# EAGLE design LED_004 (EAGLE 7.3.0)
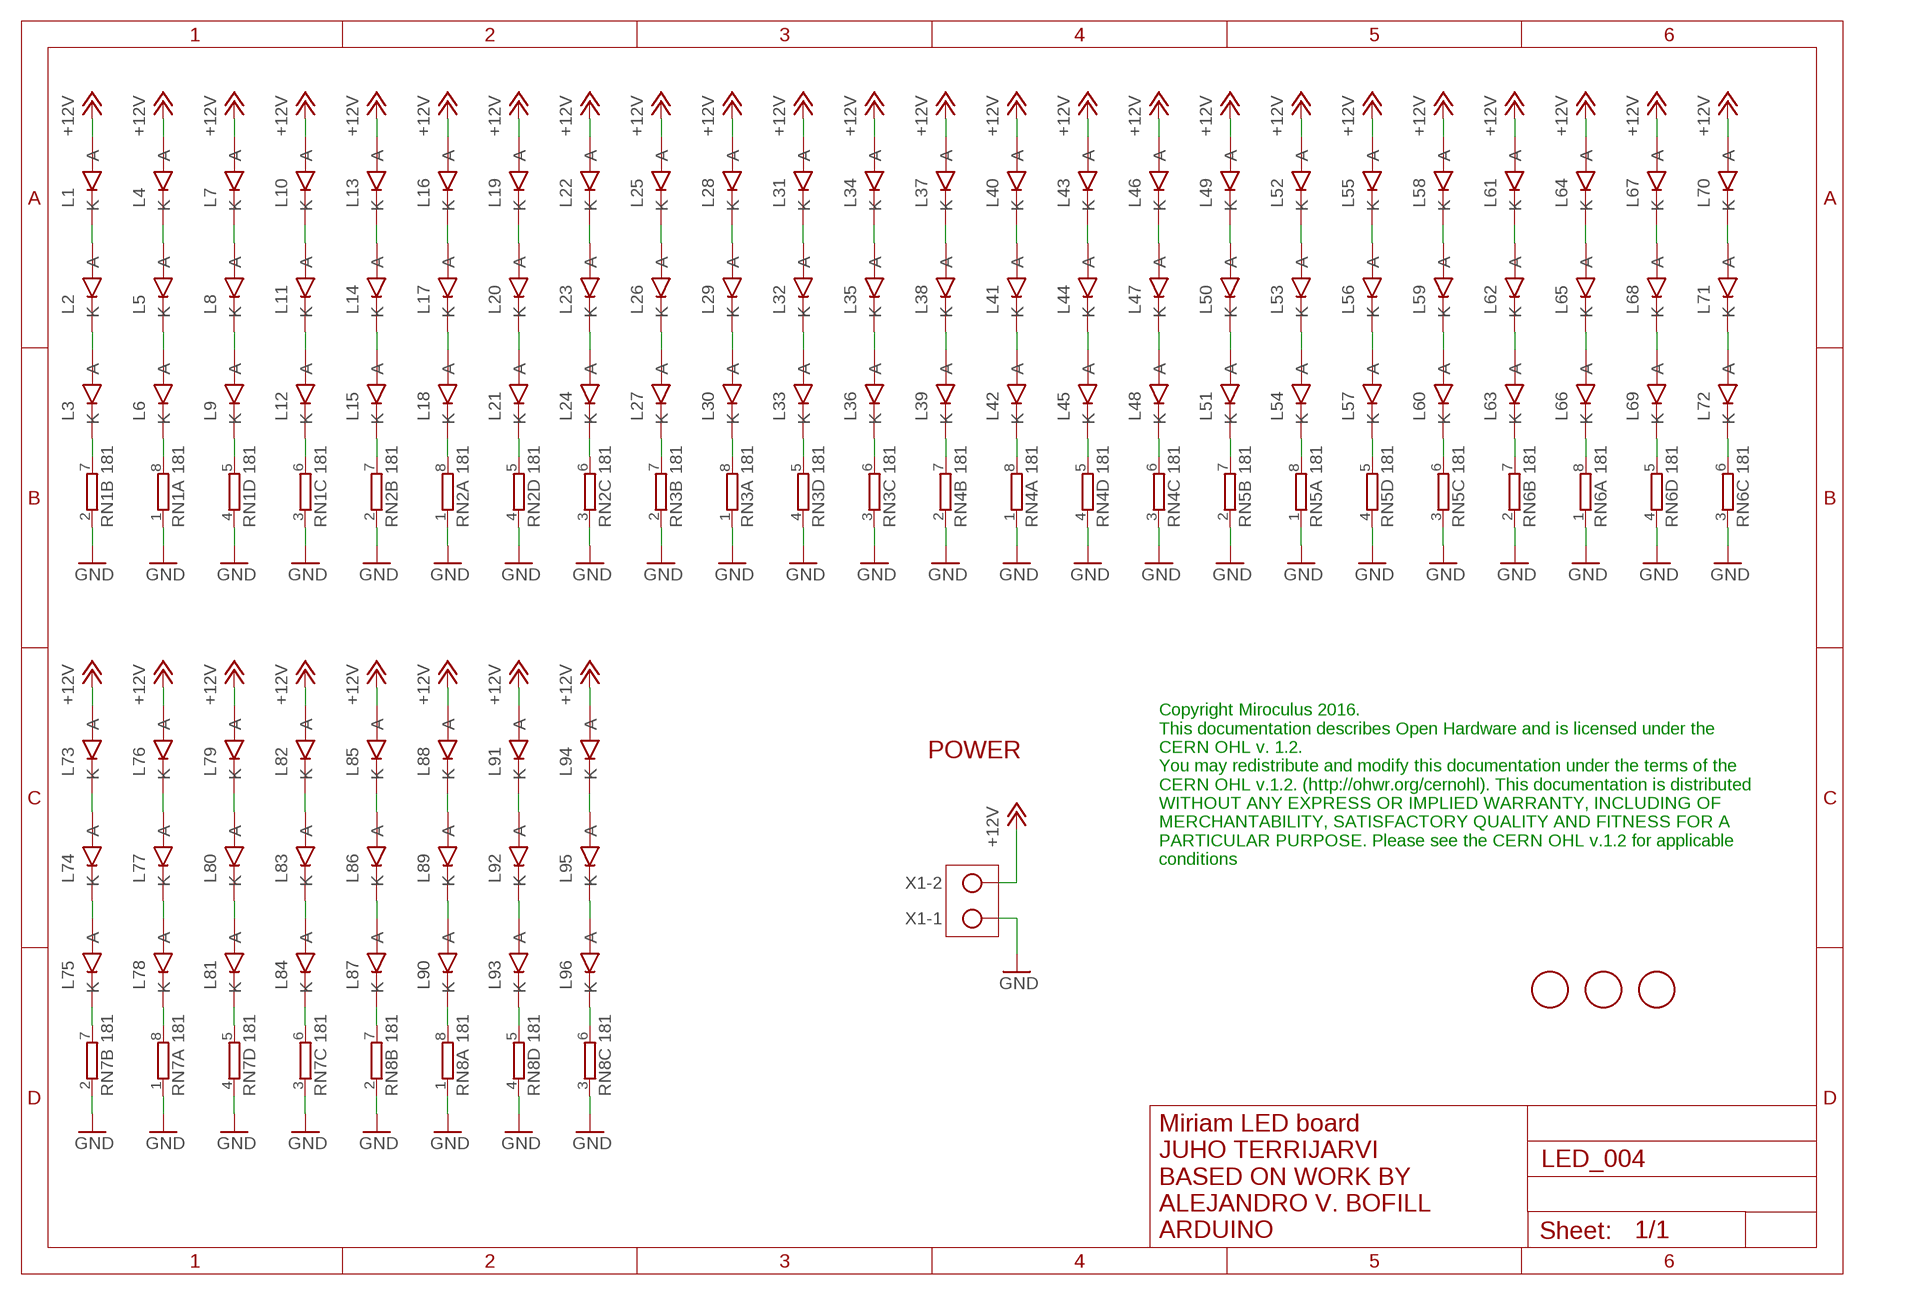
[diagram p0: schematic, sheet 1]

## Parts
FD1  FIDUCIALMOUNT  [FIDUCIA-MOUNT]
FD2  FIDUCIALMOUNT  [FIDUCIA-MOUNT]
FD3  FIDUCIALMOUNT  [FIDUCIA-MOUNT]
L1  KA-2810AQBS-G  LED_0.2  [LED_0.2]
L2  KA-2810AQBS-G  LED_0.2  [LED_0.2]
L3  KA-2810AQBS-G  LED_0.2  [LED_0.2]
L4  KA-2810AQBS-G  LED_0.2  [LED_0.2]
L5  KA-2810AQBS-G  LED_0.2  [LED_0.2]
L6  KA-2810AQBS-G  LED_0.2  [LED_0.2]
L7  KA-2810AQBS-G  LED_0.2  [LED_0.2]
L8  KA-2810AQBS-G  LED_0.2  [LED_0.2]
L9  KA-2810AQBS-G  LED_0.2  [LED_0.2]
L10  KA-2810AQBS-G  LED_0.2  [LED_0.2]
L11  KA-2810AQBS-G  LED_0.2  [LED_0.2]
L12  KA-2810AQBS-G  LED_0.2  [LED_0.2]
L13  KA-2810AQBS-G  LED_0.2  [LED_0.2]
L14  KA-2810AQBS-G  LED_0.2  [LED_0.2]
L15  KA-2810AQBS-G  LED_0.2  [LED_0.2]
L16  KA-2810AQBS-G  LED_0.2  [LED_0.2]
L17  KA-2810AQBS-G  LED_0.2  [LED_0.2]
L18  KA-2810AQBS-G  LED_0.2  [LED_0.2]
L19  KA-2810AQBS-G  LED_0.2  [LED_0.2]
L20  KA-2810AQBS-G  LED_0.2  [LED_0.2]
L21  KA-2810AQBS-G  LED_0.2  [LED_0.2]
L22  KA-2810AQBS-G  LED_0.2  [LED_0.2]
L23  KA-2810AQBS-G  LED_0.2  [LED_0.2]
L24  KA-2810AQBS-G  LED_0.2  [LED_0.2]
L25  KA-2810AQBS-G  LED_0.2  [LED_0.2]
L26  KA-2810AQBS-G  LED_0.2  [LED_0.2]
L27  KA-2810AQBS-G  LED_0.2  [LED_0.2]
L28  KA-2810AQBS-G  LED_0.2  [LED_0.2]
L29  KA-2810AQBS-G  LED_0.2  [LED_0.2]
L30  KA-2810AQBS-G  LED_0.2  [LED_0.2]
L31  KA-2810AQBS-G  LED_0.2  [LED_0.2]
L32  KA-2810AQBS-G  LED_0.2  [LED_0.2]
L33  KA-2810AQBS-G  LED_0.2  [LED_0.2]
L34  KA-2810AQBS-G  LED_0.2  [LED_0.2]
L35  KA-2810AQBS-G  LED_0.2  [LED_0.2]
L36  KA-2810AQBS-G  LED_0.2  [LED_0.2]
L37  KA-2810AQBS-G  LED_0.2  [LED_0.2]
L38  KA-2810AQBS-G  LED_0.2  [LED_0.2]
L39  KA-2810AQBS-G  LED_0.2  [LED_0.2]
L40  KA-2810AQBS-G  LED_0.2  [LED_0.2]
L41  KA-2810AQBS-G  LED_0.2  [LED_0.2]
L42  KA-2810AQBS-G  LED_0.2  [LED_0.2]
L43  KA-2810AQBS-G  LED_0.2  [LED_0.2]
L44  KA-2810AQBS-G  LED_0.2  [LED_0.2]
L45  KA-2810AQBS-G  LED_0.2  [LED_0.2]
L46  KA-2810AQBS-G  LED_0.2  [LED_0.2]
L47  KA-2810AQBS-G  LED_0.2  [LED_0.2]
L48  KA-2810AQBS-G  LED_0.2  [LED_0.2]
L49  KA-2810AQBS-G  LED_0.2  [LED_0.2]
L50  KA-2810AQBS-G  LED_0.2  [LED_0.2]
L51  KA-2810AQBS-G  LED_0.2  [LED_0.2]
L52  KA-2810AQBS-G  LED_0.2  [LED_0.2]
L53  KA-2810AQBS-G  LED_0.2  [LED_0.2]
L54  KA-2810AQBS-G  LED_0.2  [LED_0.2]
L55  KA-2810AQBS-G  LED_0.2  [LED_0.2]
L56  KA-2810AQBS-G  LED_0.2  [LED_0.2]
L57  KA-2810AQBS-G  LED_0.2  [LED_0.2]
L58  KA-2810AQBS-G  LED_0.2  [LED_0.2]
L59  KA-2810AQBS-G  LED_0.2  [LED_0.2]
L60  KA-2810AQBS-G  LED_0.2  [LED_0.2]
L61  KA-2810AQBS-G  LED_0.2  [LED_0.2]
L62  KA-2810AQBS-G  LED_0.2  [LED_0.2]
L63  KA-2810AQBS-G  LED_0.2  [LED_0.2]
L64  KA-2810AQBS-G  LED_0.2  [LED_0.2]
L65  KA-2810AQBS-G  LED_0.2  [LED_0.2]
L66  KA-2810AQBS-G  LED_0.2  [LED_0.2]
L67  KA-2810AQBS-G  LED_0.2  [LED_0.2]
L68  KA-2810AQBS-G  LED_0.2  [LED_0.2]
L69  KA-2810AQBS-G  LED_0.2  [LED_0.2]
L70  KA-2810AQBS-G  LED_0.2  [LED_0.2]
L71  KA-2810AQBS-G  LED_0.2  [LED_0.2]
L72  KA-2810AQBS-G  LED_0.2  [LED_0.2]
L73  KA-2810AQBS-G  LED_0.2  [LED_0.2]
L74  KA-2810AQBS-G  LED_0.2  [LED_0.2]
L75  KA-2810AQBS-G  LED_0.2  [LED_0.2]
L76  KA-2810AQBS-G  LED_0.2  [LED_0.2]
L77  KA-2810AQBS-G  LED_0.2  [LED_0.2]
L78  KA-2810AQBS-G  LED_0.2  [LED_0.2]
L79  KA-2810AQBS-G  LED_0.2  [LED_0.2]
L80  KA-2810AQBS-G  LED_0.2  [LED_0.2]
L81  KA-2810AQBS-G  LED_0.2  [LED_0.2]
L82  KA-2810AQBS-G  LED_0.2  [LED_0.2]
L83  KA-2810AQBS-G  LED_0.2  [LED_0.2]
L84  KA-2810AQBS-G  LED_0.2  [LED_0.2]
L85  KA-2810AQBS-G  LED_0.2  [LED_0.2]
L86  KA-2810AQBS-G  LED_0.2  [LED_0.2]
L87  KA-2810AQBS-G  LED_0.2  [LED_0.2]
L88  KA-2810AQBS-G  LED_0.2  [LED_0.2]
L89  KA-2810AQBS-G  LED_0.2  [LED_0.2]
L90  KA-2810AQBS-G  LED_0.2  [LED_0.2]
L91  KA-2810AQBS-G  LED_0.2  [LED_0.2]
L92  KA-2810AQBS-G  LED_0.2  [LED_0.2]
L93  KA-2810AQBS-G  LED_0.2  [LED_0.2]
L94  KA-2810AQBS-G  LED_0.2  [LED_0.2]
L95  KA-2810AQBS-G  LED_0.2  [LED_0.2]
L96  KA-2810AQBS-G  LED_0.2  [LED_0.2]
RN1  181  4R-NCAY16  [CAY16]
RN2  181  4R-NCAY16  [CAY16]
RN3  181  4R-NCAY16  [CAY16]
RN4  181  4R-NCAY16  [CAY16]
RN5  181  4R-NCAY16  [CAY16]
RN6  181  4R-NCAY16  [CAY16]
RN7  181  4R-NCAY16  [CAY16]
RN8  181  4R-NCAY16  [CAY16]
X1  MKDSN1,5/2-5,08  [MKDSN1,5/2-5,08]

## Nets
+12V [power12]: L1.2(A) L4.2(A) L7.2(A) L10.2(A) L13.2(A) L16.2(A) L19.2(A) L22.2(A) L25.2(A) L28.2(A) L31.2(A) L34.2(A) L37.2(A) L40.2(A) L43.2(A) L46.2(A) L49.2(A) L52.2(A) L55.2(A) L58.2(A) L61.2(A) L64.2(A) L67.2(A) L70.2(A) L73.2(A) L76.2(A) L79.2(A) L82.2(A) L85.2(A) L88.2(A) L91.2(A) L94.2(A) X1.2
GND [gnd]: RN1.1 RN1.2 RN1.3 RN1.4 RN2.1 RN2.2 RN2.3 RN2.4 RN3.1 RN3.2 RN3.3 RN3.4 RN4.1 RN4.2 RN4.3 RN4.4 RN5.1 RN5.2 RN5.3 RN5.4 RN6.1 RN6.2 RN6.3 RN6.4 RN7.1 RN7.2 RN7.3 RN7.4 RN8.1 RN8.2 RN8.3 RN8.4 X1.1
N$1: L1.1(K) L2.2(A)
N$2: L2.1(K) L3.2(A)
N$3: L3.1(K) RN1.7
N$4: L4.1(K) L5.2(A)
N$5: L5.1(K) L6.2(A)
N$6: L6.1(K) RN1.8
N$7: L7.1(K) L8.2(A)
N$8: L8.1(K) L9.2(A)
N$9: L9.1(K) RN1.5
N$10: L10.1(K) L11.2(A)
N$11: L11.1(K) L12.2(A)
N$12: L12.1(K) RN1.6
N$13: L13.1(K) L14.2(A)
N$14: L14.1(K) L15.2(A)
N$15: L16.1(K) L17.2(A)
N$16: L17.1(K) L18.2(A)
N$17: L19.1(K) L20.2(A)
N$18: L20.1(K) L21.2(A)
N$19: L22.1(K) L23.2(A)
N$20: L23.1(K) L24.2(A)
N$21: L15.1(K) RN2.7
N$22: L18.1(K) RN2.8
N$23: L21.1(K) RN2.5
N$24: L24.1(K) RN2.6
N$25: L25.1(K) L26.2(A)
N$26: L26.1(K) L27.2(A)
N$27: L28.1(K) L29.2(A)
N$28: L29.1(K) L30.2(A)
N$29: L31.1(K) L32.2(A)
N$30: L32.1(K) L33.2(A)
N$31: L34.1(K) L35.2(A)
N$32: L35.1(K) L36.2(A)
N$33: L27.1(K) RN3.7
N$34: L30.1(K) RN3.8
N$35: L33.1(K) RN3.5
N$36: L36.1(K) RN3.6
N$37: L37.1(K) L38.2(A)
N$38: L38.1(K) L39.2(A)
N$39: L40.1(K) L41.2(A)
N$41: L41.1(K) L42.2(A)
N$42: L43.1(K) L44.2(A)
N$43: L44.1(K) L45.2(A)
N$44: L46.1(K) L47.2(A)
N$45: L47.1(K) L48.2(A)
N$46: L39.1(K) RN4.7
N$47: L42.1(K) RN4.8
N$48: L45.1(K) RN4.5
N$49: L48.1(K) RN4.6
N$50: L49.1(K) L50.2(A)
N$51: L50.1(K) L51.2(A)
N$52: L52.1(K) L53.2(A)
N$53: L53.1(K) L54.2(A)
N$54: L55.1(K) L56.2(A)
N$55: L56.1(K) L57.2(A)
N$56: L58.1(K) L59.2(A)
N$57: L59.1(K) L60.2(A)
N$58: L51.1(K) RN5.7
N$59: L54.1(K) RN5.8
N$60: L57.1(K) RN5.5
N$61: L60.1(K) RN5.6
N$62: L61.1(K) L62.2(A)
N$63: L62.1(K) L63.2(A)
N$64: L64.1(K) L65.2(A)
N$65: L65.1(K) L66.2(A)
N$66: L67.1(K) L68.2(A)
N$67: L68.1(K) L69.2(A)
N$68: L70.1(K) L71.2(A)
N$69: L71.1(K) L72.2(A)
N$70: L63.1(K) RN6.7
N$71: L66.1(K) RN6.8
N$72: L69.1(K) RN6.5
N$73: L72.1(K) RN6.6
N$74: L73.1(K) L74.2(A)
N$75: L74.1(K) L75.2(A)
N$76: L76.1(K) L77.2(A)
N$77: L77.1(K) L78.2(A)
N$78: L79.1(K) L80.2(A)
N$79: L80.1(K) L81.2(A)
N$80: L82.1(K) L83.2(A)
N$81: L83.1(K) L84.2(A)
N$82: L96.1(K) RN8.6
N$83: L93.1(K) RN8.5
N$84: L90.1(K) RN8.8
N$85: L87.1(K) RN8.7
N$86: L85.1(K) L86.2(A)
N$87: L86.1(K) L87.2(A)
N$88: L88.1(K) L89.2(A)
N$89: L89.1(K) L90.2(A)
N$90: L91.1(K) L92.2(A)
N$91: L92.1(K) L93.2(A)
N$92: L94.1(K) L95.2(A)
N$93: L95.1(K) L96.2(A)
N$94: L84.1(K) RN7.6
N$95: L81.1(K) RN7.5
N$96: L78.1(K) RN7.8
N$97: L75.1(K) RN7.7

## Notes on the sheet
- POWER
- Copyright Miroculus 2016.
  This documentation describes Open Hardware and is licensed under the
  CERN OHL v. 1.2.
  You may redistribute and modify this documentation under the terms of the
  CERN OHL v.1.2. (http://ohwr.org/cernohl). This documentation is distributed
  WITHOUT ANY EXPRESS OR IMPLIED WARRANTY, INCLUDING OF
  MERCHANTABILITY, SATISFACTORY QUALITY AND FITNESS FOR A
  PARTICULAR PURPOSE. Please see the CERN OHL v.1.2 for applicable
  conditions
- Miriam LED board
  JUHO TERRIJARVI
  BASED ON WORK BY
  ALEJANDRO V. BOFILL
  ARDUINO

## Library data of the parts
FD1-FD3 = SmartPrj:FIDUCIALMOUNT
L1-L96 = Miroculus:LED_0.2
RN1-RN8 = resistor-dil:4R-N: Array Chip Resistor Source: RS Component / Phycomp; OC_FARNELL: unknown; OC_NEWARK: unknown
X1 = con-phoenix-508:MKDSN1,5/2-5,08: MKDSN 1,5/ 2-5,08 Printklemme Nennstrom: 13,5 A Nennspannung: 250 V Rastermaß: 5,08 mm Polzahl: 2 Anschlussart: Schraubanschluss Montage: Löten Anschlussrichtung Leiter/Platine: 0 ° Artikelnummer: 1729128 Source: http://eshop.phoenixcontact.com .. 1729128.pdf

## Net classes
0 default: width 0.254 mm, drill 0.406 mm, clearance 0.178 mm
1 power: width 0.406 mm, drill 0.813 mm, clearance 0.406 mm
2 gnd: width 0.254 mm, drill 0.406 mm, clearance 0.178 mm
3 power usb: width 0.305 mm, drill 0.406 mm, clearance 0.254 mm
4 power12: width 1.778 mm, drill 0.889 mm, clearance 0.406 mm

## Board
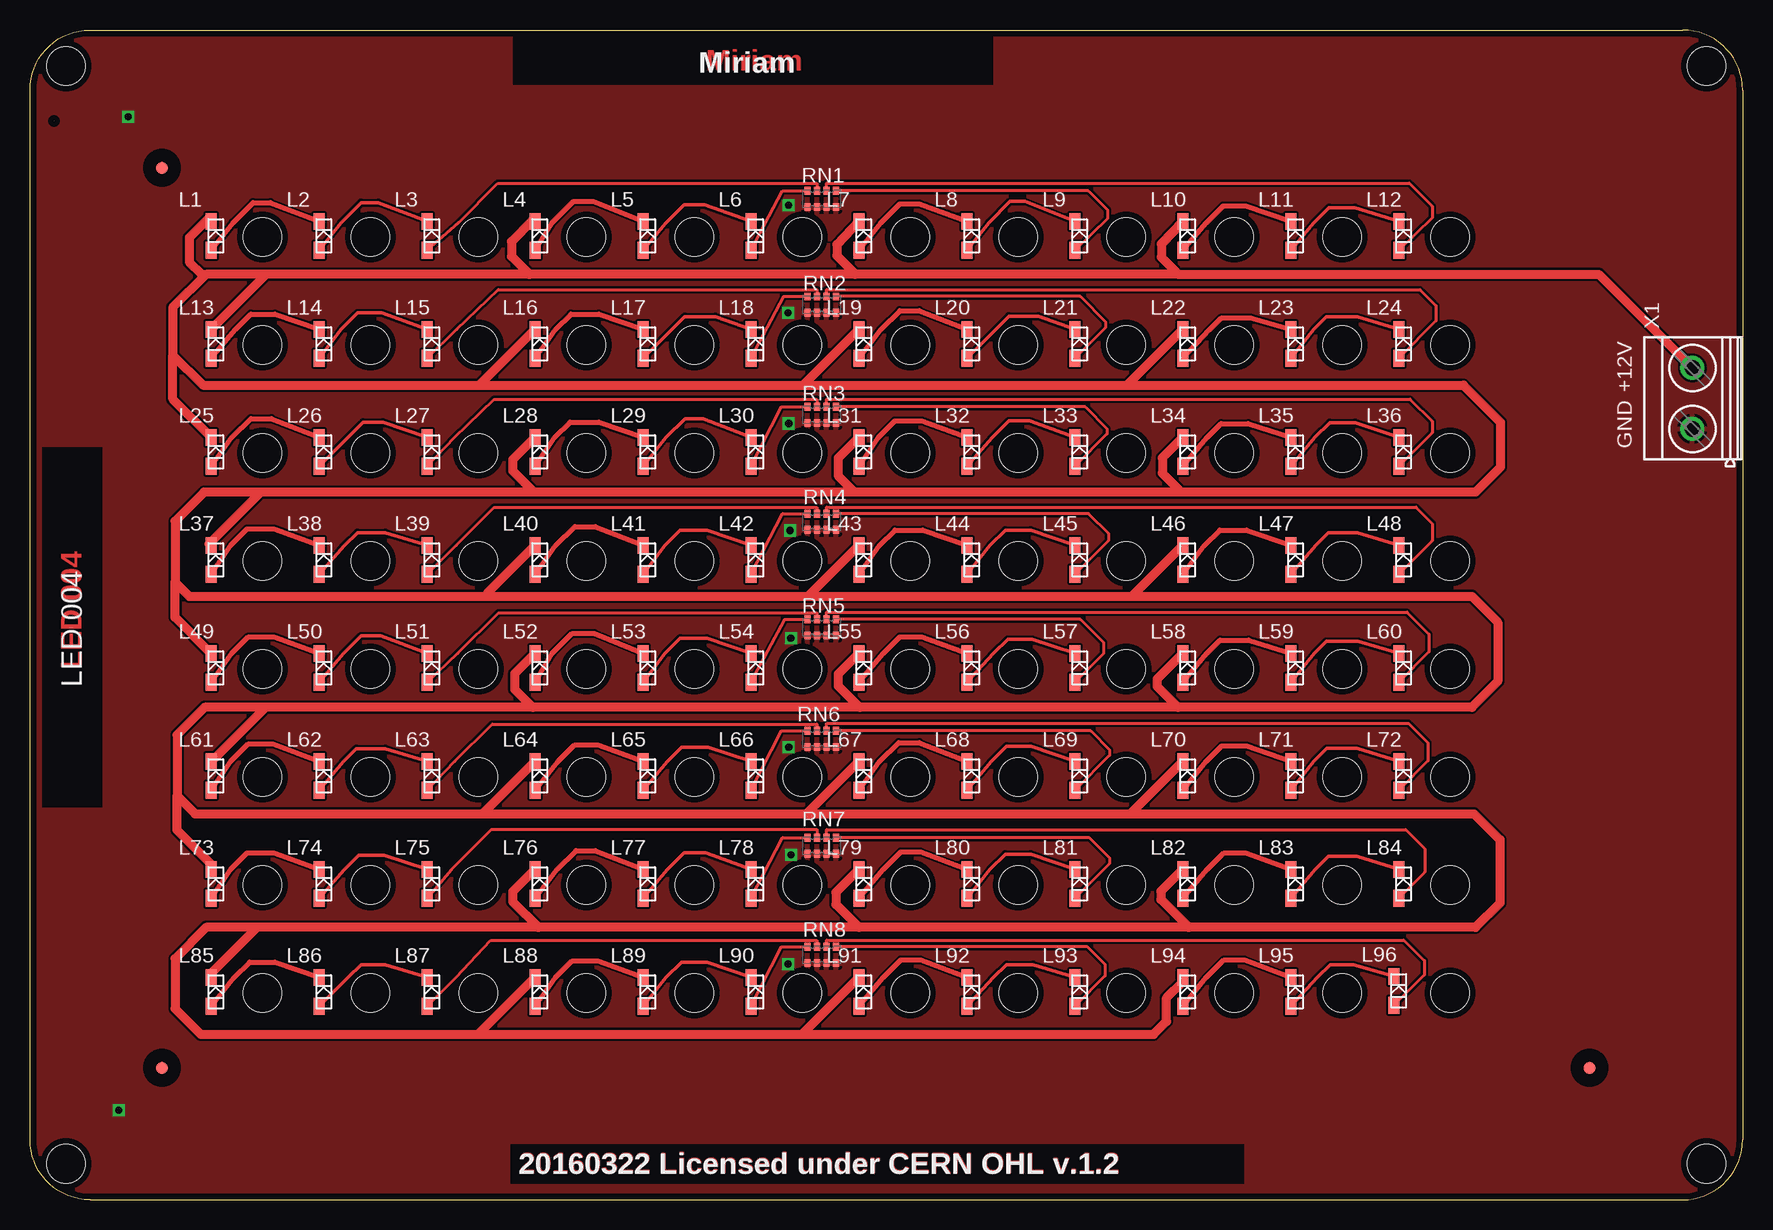
[diagram p1: board, top side]
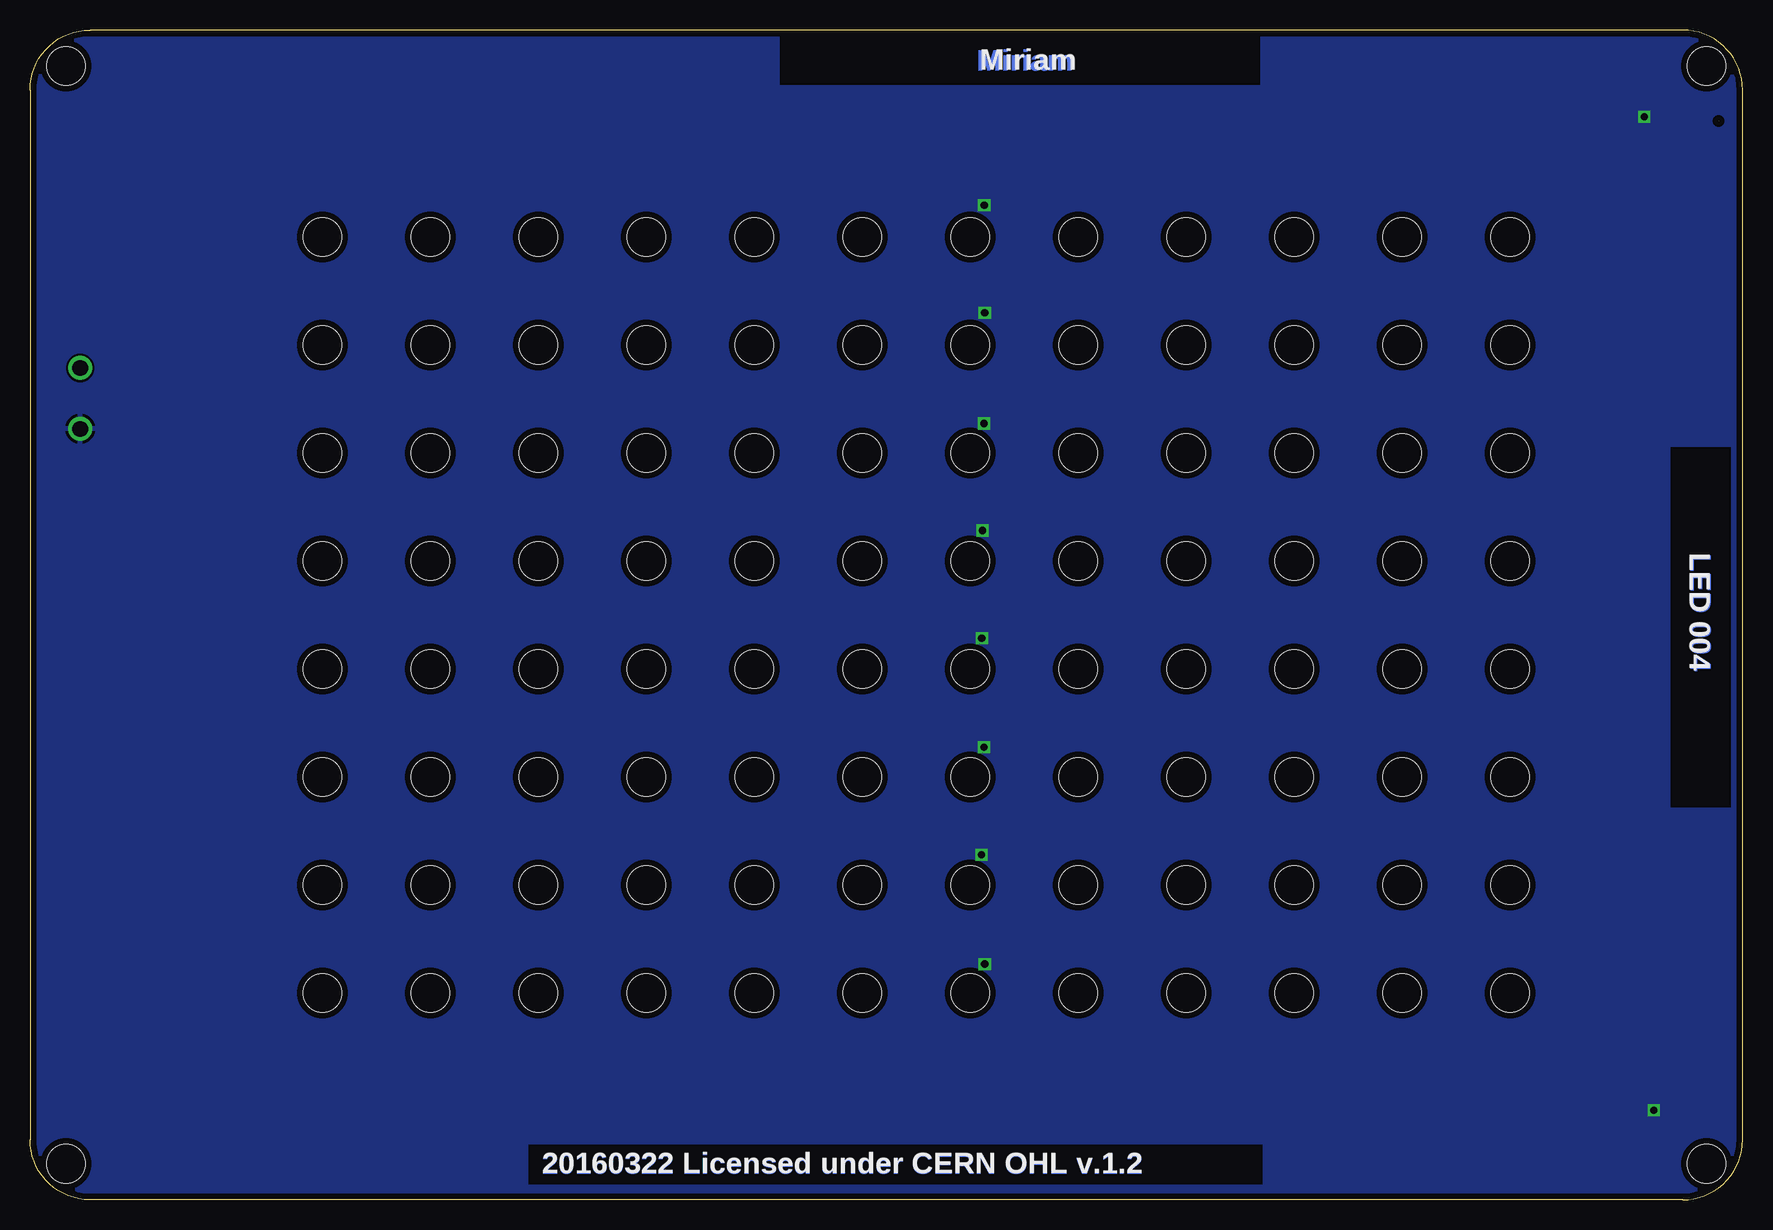
[diagram p2: board, bottom side, seen from below]

Size 142.76 x 97.48 mm. Coordinates in mm from the lower left corner, seen from the top.
Outline: 2.01,89.92 arc0 2.01,89.92
Outline: 5,0 137.76,0 arc90 142.76,5 142.76,92.48 arc90 137.76,97.48 5,97.48 arc90 0,92.48 0,5 arc90 5,0
Copper layers (1*16): Top 0.0178mm / dielectric 59mil / Bottom 0.0178mm
Design rules "SSC-EAGLE-2Lyr_v1.0.0.3": minimum track width 6mil, minimum drill 14mil, track to track 6mil, track to pad 6mil, pad to pad 6mil, via to via 6mil, smd to smd 6mil, copper to edge 20mil, drill to drill 16mil, minimum pad ring 8mil, minimum via ring 8mil, stop-mask expansion 3mil, vias tented up to drill 0mil, thermal gap 10mil
Holes 3.2 mm at 3,94.48 139.76,94.48 139.76,3 3,3 19.38,17.24 19.38,26.24 19.38,35.24 19.38,44.24 19.38,53.24 19.38,62.24 19.38,71.24 19.38,80.24 28.38,17.24 28.38,26.24 28.38,35.24 28.38,44.24 28.38,53.24 28.38,62.24 28.38,71.24 28.38,80.24 37.38,17.24 37.38,26.24 37.38,35.24 37.38,44.24 37.38,53.24 37.38,62.24 37.38,71.24 37.38,80.24 46.38,17.24 46.38,26.24 46.38,35.24 46.38,44.24 46.38,53.24 46.38,62.24 46.38,71.24 46.38,80.24 55.38,17.24 55.38,26.24 55.38,35.24 55.38,44.24 55.38,53.24 55.38,62.24 55.38,71.24 55.38,80.24 64.38,17.24 64.38,26.24 64.38,35.24 64.38,44.24 64.38,53.24 64.38,62.24 64.38,71.24 64.38,80.24 73.38,17.24 73.38,26.24 73.38,35.24 73.38,44.24 73.38,53.24 73.38,62.24 73.38,71.24 73.38,80.24 82.38,17.24 82.38,26.24 82.38,35.24 82.38,44.24 82.38,53.24 82.38,62.24 82.38,71.24 82.38,80.24 91.38,17.24 91.38,26.24 91.38,35.24 91.38,44.24 91.38,53.24 91.38,62.24 91.38,71.24 91.38,80.24 100.38,17.24 100.38,26.24 100.38,35.24 100.38,44.24 100.38,53.24 100.38,62.24 100.38,71.24 100.38,80.24 109.38,17.24 109.38,26.24 109.38,35.24 109.38,44.24 109.38,53.24 109.38,62.24 109.38,71.24 109.38,80.24 118.38,17.24 118.38,26.24 118.38,35.24 118.38,44.24 118.38,53.24 118.38,62.24 118.38,71.24 118.38,80.24
tRestrict: area 1,32.7 to 6,62.7; area 40.2,92.9 to 80.2,96.9; area 40,1.3 to 101.2,4.6
bRestrict: area 1,32.7 to 6,62.7; area 40.2,92.9 to 80.2,96.9; area 40,1.3 to 101.2,4.6

### Footprints (pad centres in the part's own frame; a part is rotated, then mirrored left to right if it is on the bottom)
FIDUCIA-MOUNT = smd 1.016 x 1.016: P$1 0,0
LED_0.2 = smd 0.9 x 1.4: 1 -0.308,-1.07; 2 -0.308,1.33
CAY16 = smd 0.5 x 0.65: 1 -1.2,-0.675; 2 -0.4,-0.675; 3 0.4,-0.675; 4 1.2,-0.675; 5 1.2,0.675; 6 0.4,0.675; 7 -0.4,0.675; 8 -1.2,0.675
MKDSN1,5/2-5,08 = drill 1.3 pad 2: 1 -2.561,0.025; 2 2.519,0.025

### Placement (x,y rotation side)
FD1  130,11 0 top
FD2  11,11 0 top
FD3  11,86 0 top
L1  15.4,80.2 0 top
L2  24.4,80.2 0 top
L3  33.4,80.2 0 top
L4  42.4,80.2 0 top
L5  51.4,80.2 0 top
L6  60.4,80.2 0 top
L7  69.4,80.2 0 top
L8  78.4,80.2 0 top
L9  87.4,80.2 0 top
L10  96.4,80.2 0 top
L11  105.4,80.2 0 top
L12  114.4,80.2 0 top
L13  15.4,71.2 0 top
L14  24.4,71.2 0 top
L15  33.4,71.2 0 top
L16  42.4,71.2 0 top
L17  51.4,71.2 0 top
L18  60.4,71.2 0 top
L19  69.4,71.2 0 top
L20  78.4,71.2 0 top
L21  87.4,71.2 0 top
L22  96.4,71.2 0 top
L23  105.4,71.2 0 top
L24  114.4,71.2 0 top
L25  15.4,62.2 0 top
L26  24.4,62.2 0 top
L27  33.4,62.2 0 top
L28  42.4,62.2 0 top
L29  51.4,62.2 0 top
L30  60.4,62.2 0 top
L31  69.4,62.2 0 top
L32  78.4,62.2 0 top
L33  87.4,62.2 0 top
L34  96.4,62.2 0 top
L35  105.4,62.2 0 top
L36  114.4,62.2 0 top
L37  15.4,53.2 0 top
L38  24.4,53.2 0 top
L39  33.4,53.2 0 top
L40  42.4,53.2 0 top
L41  51.4,53.2 0 top
L42  60.4,53.2 0 top
L43  69.4,53.2 0 top
L44  78.4,53.2 0 top
L45  87.4,53.2 0 top
L46  96.4,53.2 0 top
L47  105.4,53.2 0 top
L48  114.4,53.2 0 top
L49  15.4,44.2 0 top
L50  24.4,44.2 0 top
L51  33.4,44.2 0 top
L52  42.4,44.2 0 top
L53  51.4,44.2 0 top
L54  60.4,44.2 0 top
L55  69.4,44.2 0 top
L56  78.4,44.2 0 top
L57  87.4,44.2 0 top
L58  96.4,44.2 0 top
L59  105.4,44.2 0 top
L60  114.4,44.2 0 top
L61  15.4,35.2 0 top
L62  24.4,35.2 0 top
L63  33.4,35.2 0 top
L64  42.4,35.2 0 top
L65  51.4,35.2 0 top
L66  60.4,35.2 0 top
L67  69.4,35.2 0 top
L68  78.4,35.2 0 top
L69  87.4,35.2 0 top
L70  96.4,35.2 0 top
L71  105.4,35.2 0 top
L72  114.4,35.2 0 top
L73  15.4,26.2 0 top
L74  24.4,26.2 0 top
L75  33.4,26.2 0 top
L76  42.4,26.2 0 top
L77  51.4,26.2 0 top
L78  60.4,26.2 0 top
L79  69.4,26.2 0 top
L80  78.4,26.2 0 top
L81  87.4,26.2 0 top
L82  96.4,26.2 0 top
L83  105.4,26.2 0 top
L84  114.4,26.2 0 top
L85  15.4,17.2 0 top
L86  24.4,17.2 0 top
L87  33.4,17.2 0 top
L88  42.4,17.2 0 top
L89  51.4,17.2 0 top
L90  60.4,17.2 0 top
L91  69.4,17.2 0 top
L92  78.4,17.2 0 top
L93  87.4,17.2 0 top
L94  96.4,17.2 0 top
L95  105.4,17.2 0 top
L96  114,17.28 0 top
RN1  66,83.4 0 top
RN2  66,74.6 0 top
RN3  66,65.4 0 top
RN4  66,56.5 0 top
RN5  66,47.7 0 top
RN6  66,38.4 0 top
RN7  66,29.5 0 top
RN8  66,20.4 0 top
X1  138.6,66.8 90 top

### Tracks (layer width: path | path; a pad name or v marks a point on that pad's centre or on a via)
+12V
  Top 0.762: 95.73,77.12 68.81,77.12 | 68.81,77.12 41.63,77.12 | 41.63,77.12 19.69,77.12 | 19.69,77.12 14.68,77.12 | 14.68,77.12 11.91,74.36 11.91,70.39 | 11.91,70.39 14.43,67.88 37.44,67.88 | 37.44,67.88 64.44,67.88 | 64.44,67.88 91.44,67.88 | 91.44,67.88 119.48,67.88 122.58,64.78 122.58,61.05 120.5,58.96 95.99,58.96 | 95.99,58.96 68.73,58.96 | 68.73,58.96 42.01,58.96 | 42.01,58.96 19.23,58.96 | 19.23,58.96 14.5,58.96 12.09,56.55 12.09,51.47 | 12.09,51.47 13.28,50.28 38.15,50.28 | 38.15,50.28 64.84,50.28 | 64.84,50.28 91.84,50.28 | 91.84,50.28 120.19,50.28 122.35,48.12 122.35,43.19 120.19,41.03 95.71,41.03 | 95.71,41.03 69.16,41.03 | 69.16,41.03 41.91,41.03 | 41.91,41.03 19.63,41.03 | 19.63,41.03 14.55,41.03 12.27,38.74 12.27,33.66 | 12.27,33.66 13.77,32.17 37.85,32.17 | 37.85,32.17 64.73,32.17 | 64.73,32.17 91.73,32.17 | 91.73,32.17 120.37,32.17 122.53,30.01 122.53,24.72 120.5,22.69 96.6,22.69 | 96.6,22.69 69.11,22.69 | 69.11,22.69 42.39,22.69 | 42.39,22.69 18.92,22.69 | 18.92,22.69 14.68,22.69 12.09,20.1 12.09,15.94 14.25,13.78 37.36,13.78 | 37.36,13.78 64.34,13.78 | 64.34,13.78 93.65,13.78 94.74,14.87 94.74,16.82 96.09,18.17 L94.2 | L91.2 64.34,13.78 | L88.2 37.36,13.8 37.36,13.78 | L85.2 15.04,18.59 15.04,18.8 18.92,22.69 | L76.2 40.23,25.67 40.23,24.85 42.39,22.69 | L79.2 67.18,25.62 67.18,24.62 69.11,22.69 | L82.2 94.26,25.7 94.26,25.03 96.6,22.69 | L70.2 91.73,32.17 | L67.2 64.73,32.17 | L64.2 37.85,32.28 37.85,32.17 | L61.2 15.4,36.84 15.44,36.84 19.63,41.03 | L73.2 15.16,27.6 15.16,27.9 12.27,30.79 12.27,33.66 | L49.2 14.92,45.7 14.91,45.7 12.09,48.52 12.09,51.47 | L52.2 40.41,43.85 40.41,42.53 41.91,41.03
  Top 0.762: L55.2 67.36,43.8 67.36,42.83 69.16,41.03 | L58.2 93.95,43.39 93.95,42.78 95.71,41.03 | L46.2 91.84,50.28 | L43.2 64.84,50.28 | L40.2 38.15,50.59 38.15,50.28 | L37.2 14.98,54.65 14.91,54.65 19.23,58.96 | L25.2 11.91,66.71 11.91,70.39 | L28.2 40.23,61.67 40.23,60.74 42.01,58.96 | L31.2 67.36,61.8 67.36,60.33 68.73,58.96 | L34.2 94.39,61.82 94.39,60.56 95.99,58.96 | L22.2 91.44,67.88 | L19.2 64.44,67.88 | L16.2 37.44,67.88 | L1.2 14.85,81.67 14.78,81.67 13.28,80.17 13.28,78.14 14.3,77.12 14.68,77.12 | L4.2 41.91,81.61 41.91,81.62 40.13,79.84 40.13,78.62 41.63,77.12 | L7.2 67.26,79.6 67.26,78.67 68.81,77.12 | L10.2 94.31,79.65 94.31,78.55 95.73,77.12 | L13.2 19.69,77.12 | 95.73,77.12 130.77,77.12 X1.2
GND  (via drill 0.6)
  other vias: 63.22,82.89 63.18,73.92 63.24,64.69 63.36,55.77 63.42,46.79 63.24,37.7 63.45,28.75 63.18,19.64 7.41,7.46 8.2,90.24
  pour Bottom: -12.95,103 155.03,103 155.03,-7.62 -12.95,-7.62
  pour Top: -12.95,104 155.03,104 155.03,-7.24 -12.95,-7.24
N$1
  Top 0.406: L1.1 16.93,81.43 18.6,83.1 20.02,83.1 L2.2
N$2
  Top 0.305: L2.1 25.93,81.43 27.6,83.1 29.02,83.1 L3.2
N$3
  Top 0.254: L3.1 35.71,81.43 38.98,84.7 65.6,84.7 RN1.7
N$4
  Top 0.406: L4.1 43.53,81.43 45.3,83.2 46.92,83.2 L5.2
N$5
  Top 0.305: L5.1 53.03,81.43 54.5,82.9 56.22,82.9 L6.2
N$6
  Top 0.254: L6.1 62.74,84.08 RN1.8
N$7
  Top 0.406: L7.1 70.93,81.43 72.5,83 74.12,83 L8.2
N$8
  Top 0.305: L8.1 79.93,81.43 81.7,83.2 82.92,83.2 L9.2
N$9
  Top 0.254: RN1.5 88.22,84.08 89.81,82.48 89.81,81.75 L9.1
N$10
  Top 0.406: L10.1 98.07,81.43 99.46,82.82 101.3,82.82 L11.2
N$11
  Top 0.305: L11.1 107.04,81.43 108.29,82.68 110.44,82.68 L12.2
N$12
  Top 0.254: RN1.6 66.4,84.72 114.96,84.72 116.89,82.79 116.89,81.83 L12.1
N$13
  Top 0.406: L13.1 17.13,72.53 18.4,73.8 20.42,73.8 L14.2
N$14
  Top 0.305: L14.1 25.93,72.53 27.3,73.9 29.32,73.9 L15.2
N$15
  Top 0.406: L16.1 43.83,72.53 45.1,73.8 47.42,73.8 L17.2
N$16
  Top 0.305: L18.2 57.15,73.6 54.56,73.6 L17.1
N$17
  Top 0.406: L19.1 70.93,72.53 72.5,74.1 74.12,74.1 L20.2
N$18
  Top 0.305: L21.2 84.06,73.63 81.6,73.63 L20.1
N$19
  Top 0.406: L22.1 98.36,72.53 99.32,73.49 101.73,73.49 L23.2
N$20
  Top 0.305: L23.1 107.01,72.53 108.06,73.58 110.64,73.58 L24.2
N$21
  Top 0.254: L15.1 35.56,72.53 39.04,75.85 65.6,75.85 RN2.7
N$22
  Top 0.254: L18.1 62.84,75.28 RN2.8
N$23
  Top 0.254: RN2.5 87.55,75.28 89.64,73.19 89.64,72.67 L21.1
N$24
  Top 0.254: RN2.6 66.4,75.84 115.87,75.84 117.2,74.51 117.2,73.23 L24.1
N$25
  Top 0.406: L25.1 16.83,63.53 18.4,65.1 20.12,65.1 L26.2
N$26
  Top 0.305: L27.2 29.42,64.8 27.76,64.8 L26.1
N$27
  Top 0.406: L28.1 43.73,63.53 45,64.8 47.42,64.8 L29.2
N$28
  Top 0.305: L29.1 53.03,63.53 54.6,65.1 56.12,65.1 L30.2
N$29
  Top 0.406: L31.1 70.73,63.53 72.1,64.9 74.32,64.9 L32.2
N$30
  Top 0.305: L32.1 80.23,63.53 81.6,64.9 83.32,64.9 L33.2
N$31
  Top 0.406: L34.1 98.14,63.53 99.28,64.67 101.55,64.67 L35.2
N$32
  Top 0.305: L35.1 107.11,63.53 108.34,64.76 110.46,64.76 L36.2
N$33
  Top 0.254: L27.1 35.39,63.53 38.71,66.71 65.6,66.71 RN3.7
N$34
  Top 0.254: L30.1 62.64,66.08 RN3.8
N$35
  Top 0.254: RN3.5 87.96,66.08 89.79,64.25 89.79,63.83 L33.1
N$36
  Top 0.254: RN3.6 66.4,66.72 115.03,66.72 116.89,64.86 116.89,63.93 L36.1
N$37
  Top 0.406: L37.1 16.73,54.53 18.1,55.9 20.32,55.9 L38.2
N$38
  Top 0.305: L38.1 26.23,54.53 27.3,55.6 29.62,55.6 L39.2
N$39
  Top 0.406: L40.1 43.83,54.53 45.4,56.1 47.12,56.1 L41.2
N$41
  Top 0.305: L41.1 52.93,54.53 54.2,55.8 56.42,55.8 L42.2
N$42
  Top 0.406: L43.1 70.83,54.53 72.1,55.8 74.42,55.8 L44.2
N$43
  Top 0.305: L44.1 80.03,54.53 81.3,55.8 83.42,55.8 L45.2
N$44
  Top 0.406: L46.1 97.9,54.53 99.18,55.81 101.41,55.81 L47.2
N$45
  Top 0.305: L47.1 107.19,54.53 108.24,55.58 110.64,55.58 L48.2
N$46
  Top 0.254: L39.1 35.52,54.53 38.69,57.7 65.6,57.7 RN4.7
N$47
  Top 0.254: L42.1 62.74,57.17 RN4.8
N$48
  Top 0.254: RN4.5 88.25,57.17 89.89,55.53 89.89,54.93 L45.1
N$49
  Top 0.254: RN4.6 66.4,57.71 115.52,57.71 116.89,56.35 116.89,54.93 L48.1
N$50
  Top 0.406: L49.1 16.83,45.53 18.2,46.9 20.32,46.9 L50.2
N$51
  Top 0.305: L50.1 26.13,45.53 27.6,47 29.22,47 L51.2
N$52
  Top 0.406: L52.1 43.53,45.53 45.2,47.2 47.02,47.2 L53.2
N$53
  Top 0.305: L53.1 52.93,45.53 54.2,46.8 56.42,46.8 L54.2
N$54
  Top 0.406: L55.1 71.13,45.53 72.5,46.9 74.32,46.9 L56.2
N$55
  Top 0.305: L56.1 80.33,45.53 81.5,46.7 83.52,46.7 L57.2
N$56
  Top 0.406: L58.1 98.1,45.53 99.2,46.63 101.59,46.63 L59.2
N$57
  Top 0.305: L59.1 107.06,45.53 108.06,46.53 110.7,46.53 L60.2
N$58
  Top 0.254: L51.1 35.66,45.53 39.05,48.91 65.6,48.91 RN5.7
N$59
  Top 0.254: L54.1 62.94,48.38 RN5.8
N$60
  Top 0.254: RN5.5 87.55,48.38 89.46,46.47 89.46,45.5 L57.1
N$61
  Top 0.254: RN5.6 66.4,48.96 114.77,48.96 116.61,47.13 116.61,45.65 L60.1
N$62
  Top 0.406: L61.1 16.73,36.53 18.2,38 20.22,38 L62.2
N$63
  Top 0.305: L62.1 26.13,36.53 27.2,37.6 29.62,37.6 L63.2
N$64
  Top 0.406: L64.1 44.03,36.53 45.4,37.9 47.32,37.9 L65.2
N$65
  Top 0.305: L65.1 53.13,36.53 54.3,37.7 56.52,37.7 L66.2
N$66
  Top 0.406: L67.1 70.83,36.53 72.4,38.1 74.12,38.1 L68.2
N$67
  Top 0.305: L68.1 80.13,36.53 81.4,37.8 83.42,37.8 L69.2
N$68
  Top 0.406: L70.1 98.05,36.53 99.34,37.81 101.41,37.81 L71.2
N$69
  Top 0.305: L71.1 107.01,36.53 108.1,37.62 110.6,37.62 L72.2
N$70
  Top 0.254: L63.1 35.42,36.53 38.53,39.64 65.6,39.64 RN6.7
N$71
  Top 0.254: L66.1 62.64,39.08 RN6.8
N$72
  Top 0.254: RN6.5 88.42,39.08 89.99,37.5 89.99,37.03 L69.1
N$73
  Top 0.254: RN6.6 66.4,39.71 114.91,39.71 116.53,38.08 116.53,36.57 L72.1
N$74
  Top 0.406: L73.1 16.73,27.53 18.1,28.9 20.32,28.9 L74.2
N$75
  Top 0.305: L74.1 26.23,27.53 27.4,28.7 29.52,28.7 L75.2
N$76
  Top 0.406: L76.1 43.93,27.53 45.5,29.1 47.12,29.1 L77.2
N$77
  Top 0.305: L77.1 53.13,27.53 54.5,28.9 56.32,28.9 L78.2
N$78
  Top 0.406: L79.1 71.13,27.53 72.6,29 74.22,29 L80.2
N$79
  Top 0.305: L80.1 80.03,27.53 81.3,28.8 83.42,28.8 L81.2
N$80
  Top 0.406: L82.1 98.16,27.53 99.53,28.9 101.32,28.9 L83.2
N$81
  Top 0.305: L83.1 107.15,27.53 108.24,28.62 110.6,28.62 L84.2
N$82
  Top 0.254: RN8.6 66.4,21.65 114.51,21.65 116.23,19.92 116.23,18.75 L96.1
N$83
  Top 0.254: RN8.5 88.15,21.07 89.61,19.62 89.61,18.65 L93.1
N$84
  Top 0.254: L90.1 62.64,21.07 RN8.8
N$85
  Top 0.254: L87.1 35.51,18.53 38.41,21.62 65.6,21.62 RN8.7
N$86
  Top 0.406: L85.1 17.03,18.53 18.3,19.8 20.42,19.8 L86.2
N$87
  Top 0.305: L86.1 26.53,18.53 27.6,19.6 29.62,19.6 L87.2
N$88
  Top 0.406: L88.1 43.83,18.53 45.2,19.9 47.32,19.9 L89.2
N$89
  Top 0.305: L89.1 53.03,18.53 54.3,19.8 56.42,19.8 L90.2
N$90
  Top 0.406: L91.1 71.13,18.53 72.6,20 74.22,20 L92.2
N$91
  Top 0.305: L92.1 80.33,18.53 81.4,19.6 83.62,19.6 L93.2
N$92
  Top 0.406: L94.1 98.06,18.53 99.53,20 101.23,20 L95.2
N$93
  Top 0.305: L95.1 107.33,18.53 108.38,19.58 110.33,19.58 L96.2
N$94
  Top 0.254: RN7.6 66.4,30.84 114.69,30.84 116.26,29.27 116.26,27.29 L84.1
N$95
  Top 0.254: RN7.5 88.3,30.18 89.97,28.51 89.97,28 L81.1
N$96
  Top 0.254: L78.1 62.74,30.18 RN7.8
N$97
  Top 0.254: L75.1 35.14,27.53 38.48,30.87 65.6,30.87 RN7.7

### Text on the board
Top: Miriam | LED 004 | 20160322 Licensed under CERN OHL v.1.2
Bottom: Miriam | LED 004 | 20160322 Licensed under CERN OHL v.1.2
tPlace: +12V | GND
tNames: Miriam | LED 004 | 20160322 Licensed under CERN OHL v.1.2
bNames: Miriam | LED 004 | 20160322 Licensed under CERN OHL v.1.2